# EAGLE schematic shield (EAGLE 7.1.0)
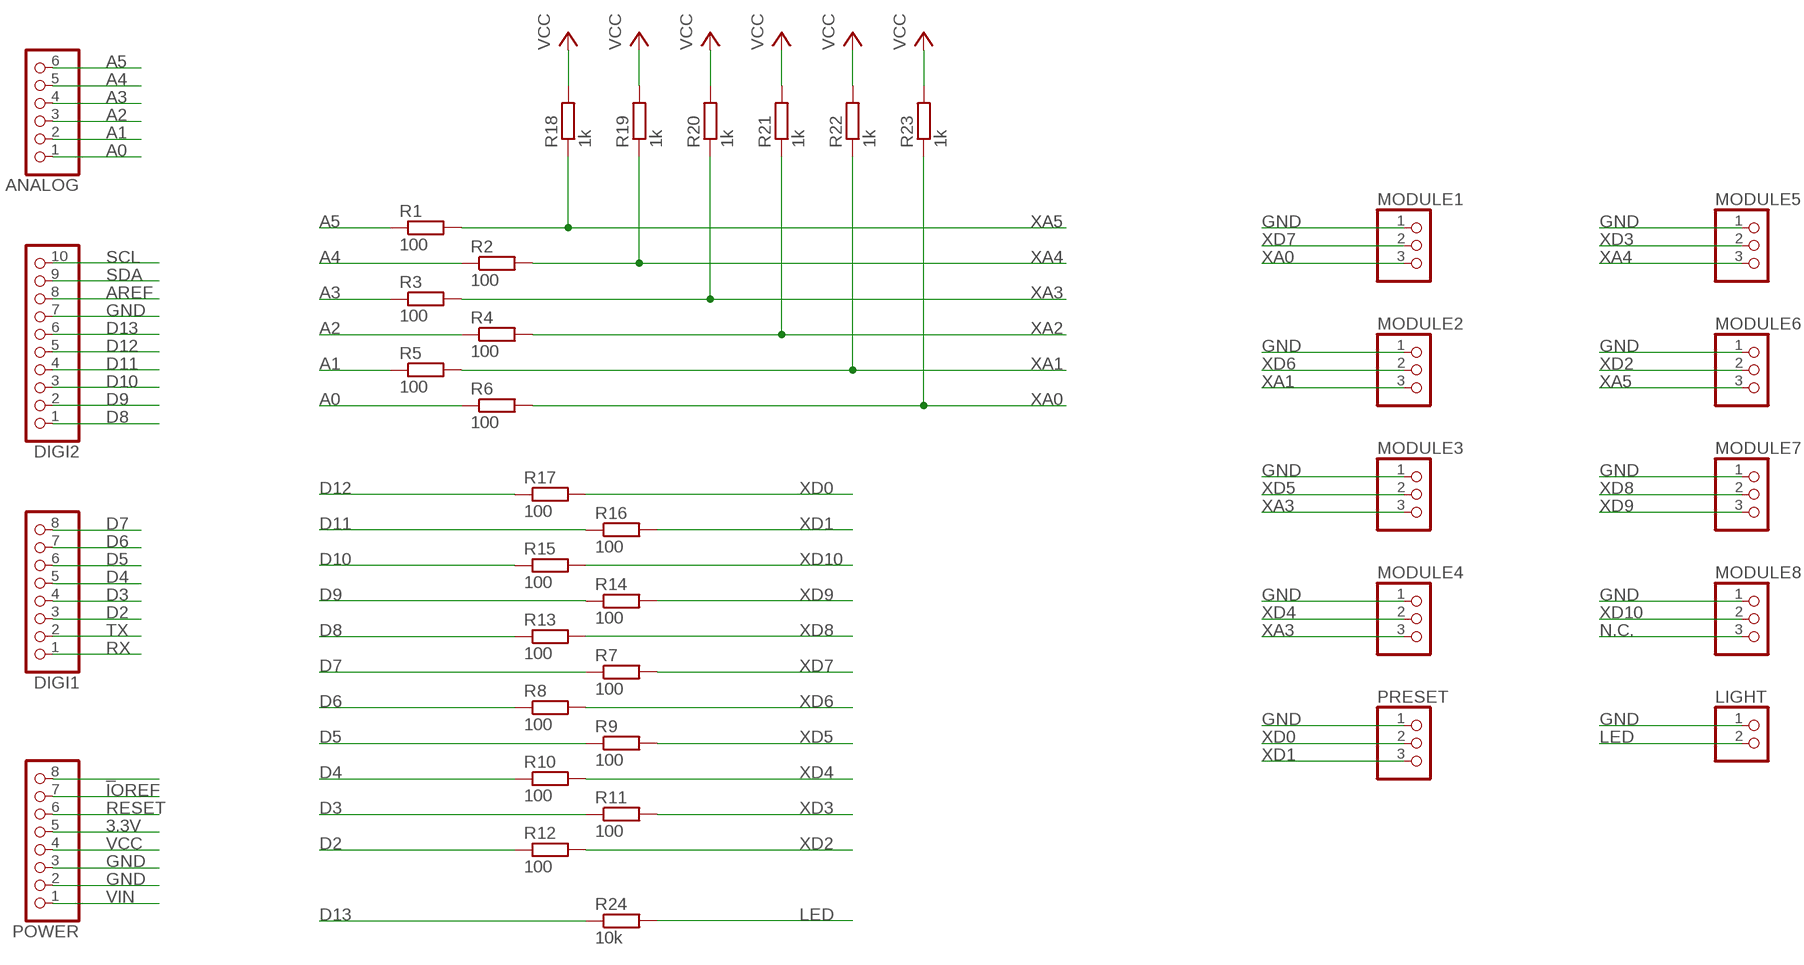
[diagram p0: schematic, sheet 1]

## Parts
ANALOG  PINHD-1X6  [1X06]
DIGI1  PINHD-1X8  [1X08]
DIGI2  PINHD-1X10  [1X10]
LIGHT  PINHD-1X2  [1X02]
MODULE1  PINHD-1X3  [1X03]
MODULE2  PINHD-1X3  [1X03]
MODULE3  PINHD-1X3  [1X03]
MODULE4  PINHD-1X3  [1X03]
MODULE5  PINHD-1X3  [1X03]
MODULE6  PINHD-1X3  [1X03]
MODULE7  PINHD-1X3  [1X03]
MODULE8  PINHD-1X3  [1X03]
POWER  PINHD-1X8  [1X08]
PRESET  PINHD-1X3  [1X03]
R1  100  R-EU_0207/7  [0207/7]
R2  100  R-EU_0207/7  [0207/7]
R3  100  R-EU_0207/7  [0207/7]
R4  100  R-EU_0207/7  [0207/7]
R5  100  R-EU_0207/7  [0207/7]
R6  100  R-EU_0207/7  [0207/7]
R7  100  R-EU_0207/7  [0207/7]
R8  100  R-EU_0207/7  [0207/7]
R9  100  R-EU_0207/7  [0207/7]
R10  100  R-EU_0207/7  [0207/7]
R11  100  R-EU_0207/7  [0207/7]
R12  100  R-EU_0207/7  [0207/7]
R13  100  R-EU_0207/7  [0207/7]
R14  100  R-EU_0207/7  [0207/7]
R15  100  R-EU_0207/7  [0207/7]
R16  100  R-EU_0207/7  [0207/7]
R17  100  R-EU_0207/7  [0207/7]
R18  1k  R-EU_0207/7  [0207/7]
R19  1k  R-EU_0207/7  [0207/7]
R20  1k  R-EU_0207/7  [0207/7]
R21  1k  R-EU_0207/7  [0207/7]
R22  1k  R-EU_0207/7  [0207/7]
R23  1k  R-EU_0207/7  [0207/7]
R24  10k  R-EU_0207/7  [0207/7]

## Nets
3.3V: POWER.5
_: POWER.8
A0: ANALOG.1 R6.1
A1: ANALOG.2 R5.1
A2: ANALOG.3 R4.1
A3: ANALOG.4 R3.1
A4: ANALOG.5 R2.1
A5: ANALOG.6 R1.1
AREF: DIGI2.8
D2: DIGI1.3 R12.1
D3: DIGI1.4 R11.1
D4: DIGI1.5 R10.1
D5: DIGI1.6 R9.1
D6: DIGI1.7 R8.1
D7: DIGI1.8 R7.1
D8: DIGI2.1 R13.1
D9: DIGI2.2 R14.1
D10: DIGI2.3 R15.1
D11: DIGI2.4 R16.1
D12: DIGI2.5 R17.1
D13: DIGI2.6 R24.1
GND: DIGI2.7 LIGHT.1 MODULE1.1 MODULE2.1 MODULE3.1 MODULE4.1 MODULE5.1 MODULE6.1 MODULE7.1 MODULE8.1 POWER.2 POWER.3 PRESET.1
IOREF: POWER.7
LED: LIGHT.2 R24.2
N.C.: MODULE8.3
RESET: POWER.6
RX: DIGI1.1
SCL: DIGI2.10
SDA: DIGI2.9
TX: DIGI1.2
VCC: POWER.4 R18.2 R19.2 R20.2 R21.2 R22.2 R23.2
VIN: POWER.1
XA0: MODULE1.3 R6.2 R23.1
XA1: MODULE2.3 R5.2 R22.1
XA2: R4.2 R21.1
XA3: MODULE3.3 MODULE4.3 R3.2 R20.1
XA4: MODULE5.3 R2.2 R19.1
XA5: MODULE6.3 R1.2 R18.1
XD0: PRESET.2 R17.2
XD1: PRESET.3 R16.2
XD2: MODULE6.2 R12.2
XD3: MODULE5.2 R11.2
XD4: MODULE4.2 R10.2
XD5: MODULE3.2 R9.2
XD6: MODULE2.2 R8.2
XD7: MODULE1.2 R7.2
XD8: MODULE7.2 R13.2
XD9: MODULE7.3 R14.2
XD10: MODULE8.2 R15.2

## Library data of the parts
ANALOG = pinhead:PINHD-1X6: PIN HEADER
DIGI1 POWER = pinhead:PINHD-1X8: PIN HEADER
DIGI2 = pinhead:PINHD-1X10: PIN HEADER
LIGHT = pinhead:PINHD-1X2: PIN HEADER
MODULE1-MODULE8 PRESET = pinhead:PINHD-1X3: PIN HEADER
R1-R24 = rcl:R-EU_: RESISTOR, European symbol